# Altium schematic sheet joint_board_can.SchDoc
size A; DocumentNumber: 2
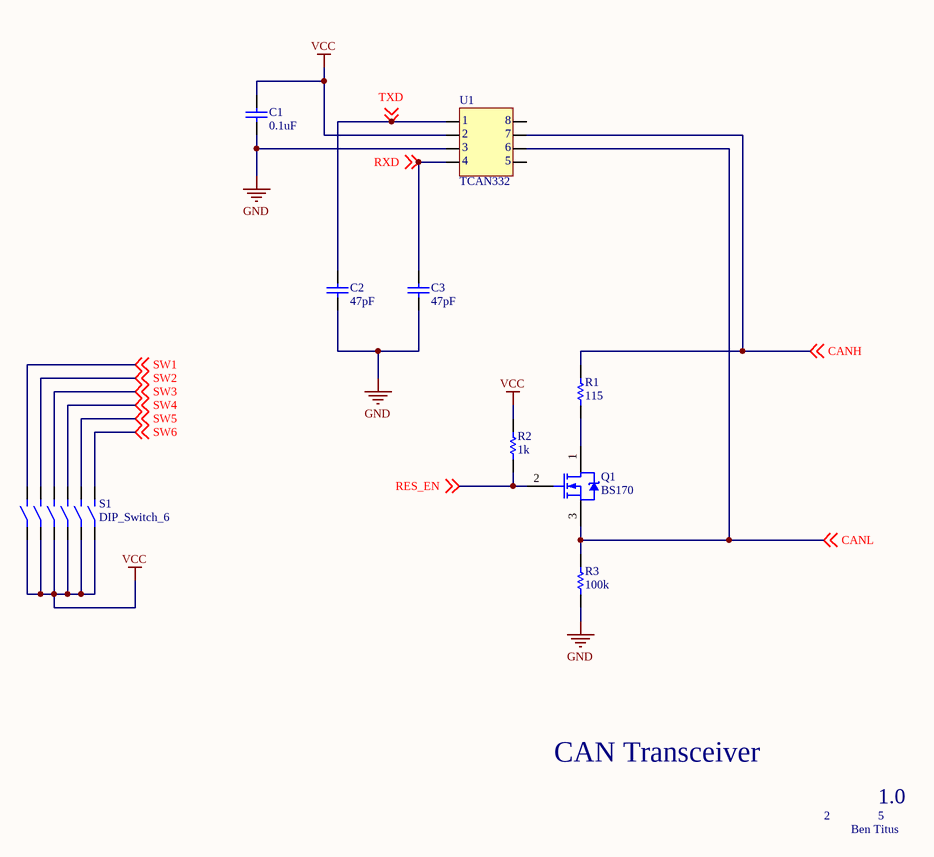
[diagram p0: joint_board_can.SchDoc]

## Parts
C1  0.1uF  [CAPC0805(2012)145_L]
C2  47pF  [CAPC0805(2012)145_L]
C3  47pF  [CAPC0805(2012)145_L]
Q1  BS170  [SOT23-3]
R1  115  [RESC0805(2012)_L]
R2  1k  [RESC0805(2012)_L]
R3  100k  [RESC0805(2012)_L]
S1  DIP_Switch_6  [SOP12]
U1  TCAN332  [SOP8]

## Nets
GND: C1.1 C2.1 C3.1 R3.1 U1.3
VCC: C1.2 R2.2 S1.1 S1.2 S1.3 S1.4 S1.5 S1.6 U1.2
CANH: R1.2 U1.7 ; off-sheet CANH
CANL: Q1.3(S) R3.2 U1.6 ; off-sheet CANL
RES_EN: Q1.2(G) R2.1 ; off-sheet RES_EN
RXD: C3.2 U1.4 ; off-sheet RXD
SW1: S1.12 ; off-sheet SW1
SW2: S1.11 ; off-sheet SW2
SW3: S1.10 ; off-sheet SW3
SW4: S1.9 ; off-sheet SW4
SW5: S1.8 ; off-sheet SW5
SW6: S1.7 ; off-sheet SW6
TXD: C2.2 U1.1 ; off-sheet TXD
NetQ1_1: Q1.1(D) R1.1

Not connected (* = marked no-connect by the designer): U1 5 8

## Notes on the sheet
- CAN Transceiver
- 2
- 1.0
- 5
- Ben Titus

## Library data of the parts
C1-C3 = CMP-1590-00003-1: 0805 (2012 Metric) Chip Capacitor; Case-EIA: 0805; Case-Metric: 2012; PackageReference: CAPC0805(2012)145
Q1 = BS170: Small Signal MOSFET, 500 mA, 60 V, N-Channel, 3-Pin TO-92, Bulk Box; pin to pad: 1>3 2>1 3>2; Manufacturer: On Semiconductor; Channel Polarity: N Channel; Configuration: Single; ID Max (A): 0.5; PD Max (W): 0.35; V(BR)DSS Min (V): 60; VGS Max (V): 20; VGS(th) Max (V): 3; DatasheetVersion: Rev. 6; PackageVersion: Rev. AM; PackageReference: TO-92-3-29-11_AM_SL; PackageDescription: 3-Pin Transistor Outline, Body 4.825 x 3.685 mm, Pitch 1.27 mm; Supplier 1: Digi-Key; Supplier Part Number 1: BS170OS-ND; Package Type: TO-92; Packing: Bulk Box; Mounting Technology: Through Hole; PartNumber: BS170; ComponentLink1Description: Manufacturer URL; ComponentLink1URL: http://www.onsemi.com/; ComponentLink2Description: Datasheet; ComponentLink2URL: http://www.onsemi.com/pub_link/Collateral/BS170-D.PDF; ComponentLink3Description: Package Specification; ComponentLink3URL: http://www.onsemi.cn/pub_link/Collateral/2N6426-D.PDF
R1-R3 = CMP-1591-00002-1: 0805 (2012 Metric) Chip Resistor; Case-EIA: 0805; Case-Metric: 2012; PackageReference: RESC0805(2012)
S1 = DIP_Switch_6: 6 pin DIP switch
U1 = TCAN332: 3.3V CAN Transceiver